# Altium schematic sheet Amplifier_1.SchDoc
size B; SheetNumber: 2; SheetTotal: 7; SPICEModelCacheXOIHOEUF: <root> / <DocumentId>XOIHOEUF</DocumentId> / </root>
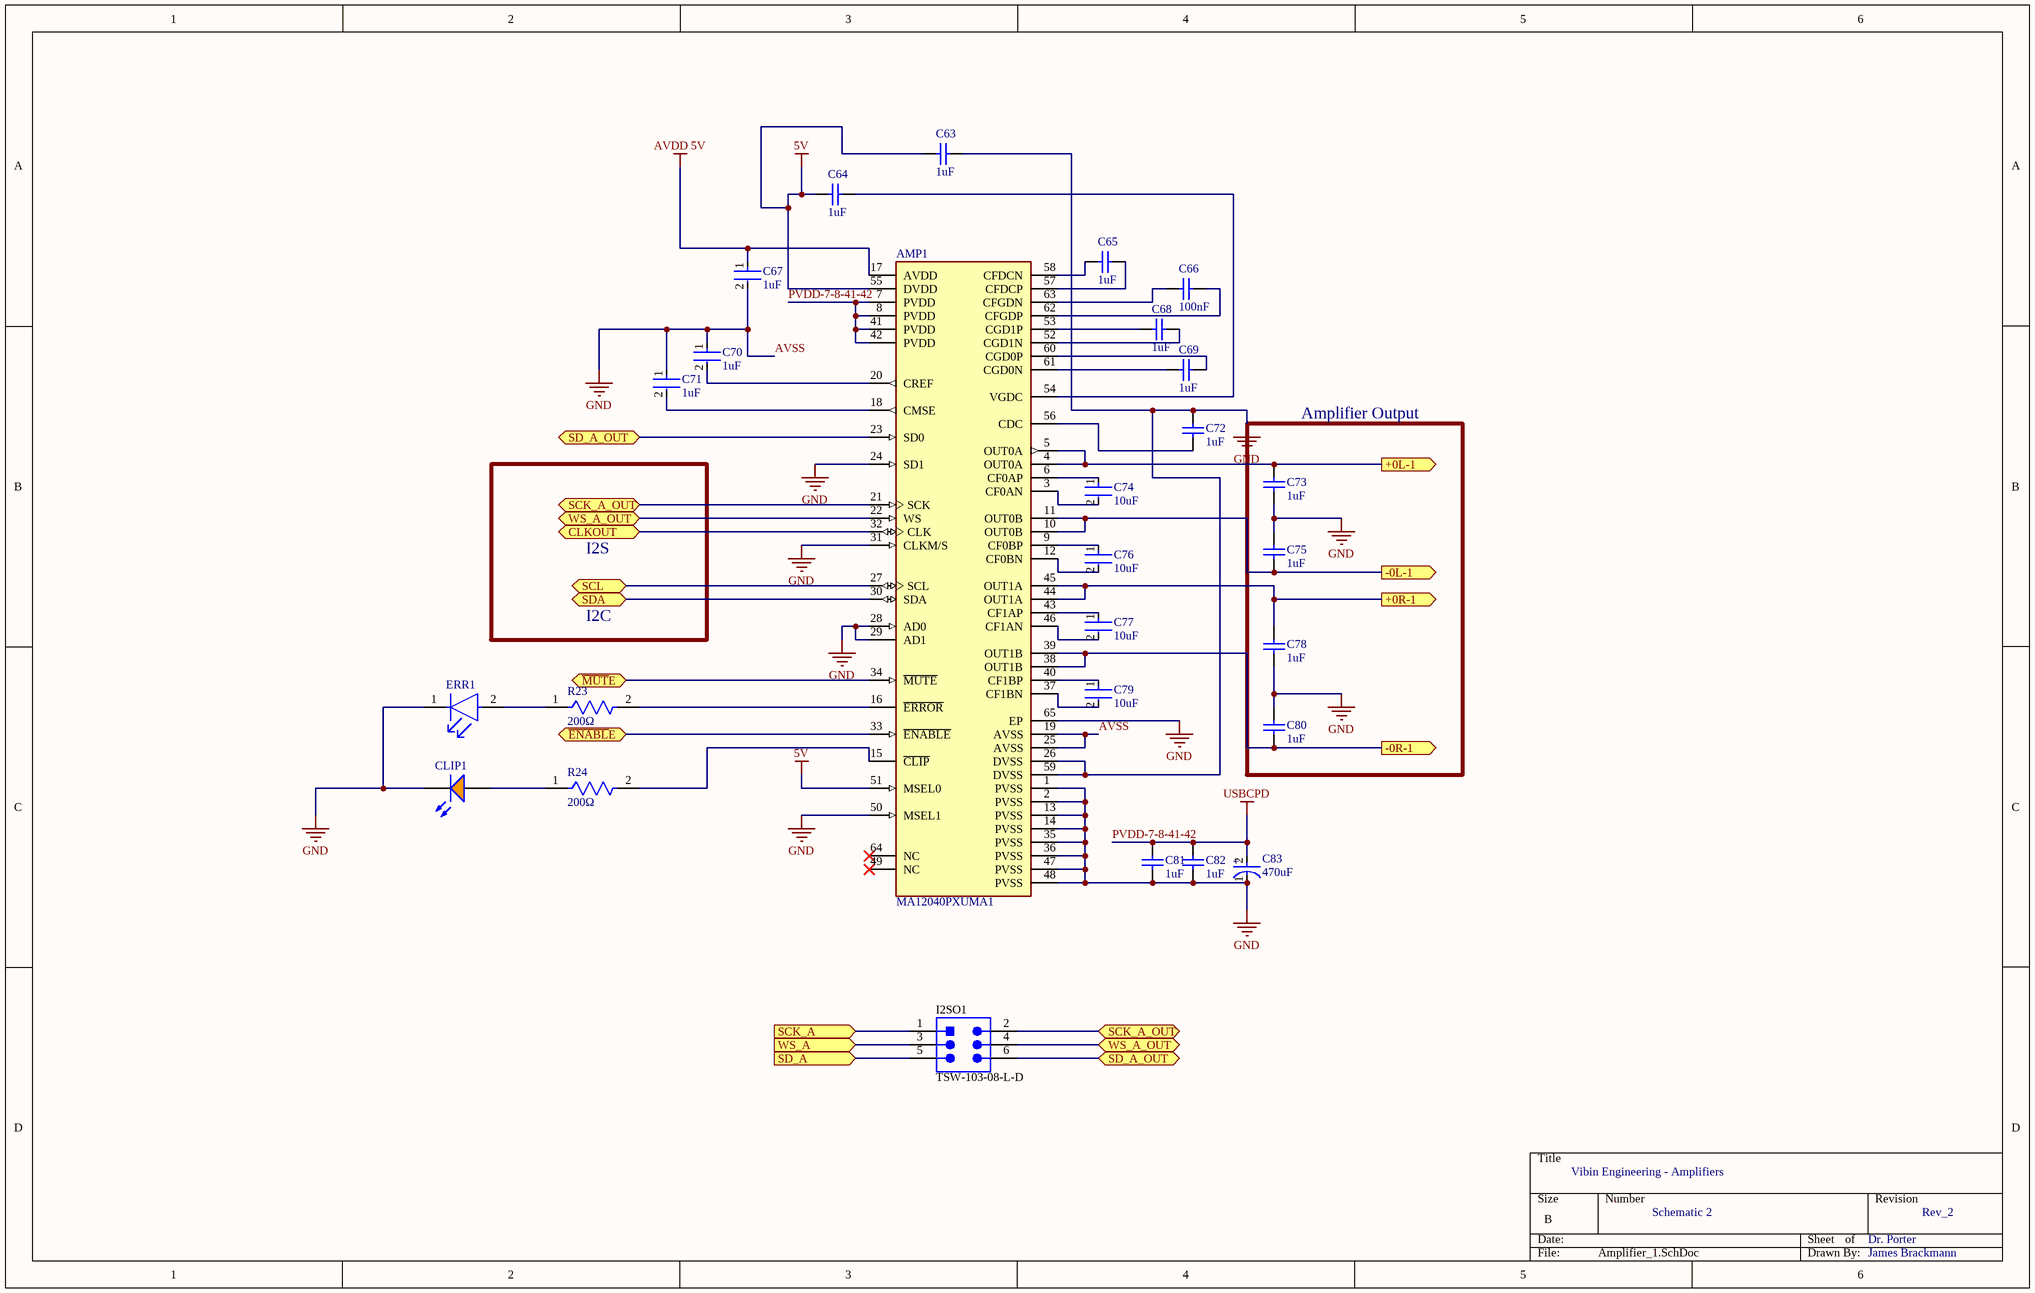
[diagram p0: Amplifier_1.SchDoc]

## Parts
AMP1  MA12040PXUMA1  [FP-PG-VQFN-64-IPC_B]
C63  1uF  [CAPC1608X90X35LL15T15]
C64  1uF  [CAPC1608X90X35LL15T15]
C65  1uF  [CAPC1608X90X35LL15T15]
C66  100nF  [CAPC1608X90X35ML10T15]
C67  1uF  [FP-GRM15-0_1-MFG]
C68  1uF  [CAPC1608X90X35LL15T15]
C69  1uF  [CAPC1608X90X35LL15T15]
C70  1uF  [FP-GRM15-0_1-MFG]
C71  1uF  [FP-GRM15-0_1-MFG]
C72  1uF  [CAPC1608X90X35LL15T15]
C73  1uF  [CAPC1608X90X35LL15T15]
C74  10uF  [FP-1210-L_3_3_0_4-W_2_5_0-MFG]
C75  1uF  [CAPC1608X90X35LL15T15]
C76  10uF  [FP-1210-L_3_3_0_4-W_2_5_0-MFG]
C77  10uF  [FP-1210-L_3_3_0_4-W_2_5_0-MFG]
C78  1uF  [CAPC1608X90X35LL15T15]
C79  10uF  [FP-1210-L_3_3_0_4-W_2_5_0-MFG]
C80  1uF  [CAPC1608X90X35LL15T15]
C81  1uF  [CAPC1608X90X35LL15T15]
C82  1uF  [CAPC1608X90X35LL15T15]
C83  470uF  [FP-OS-CON-SMT-E12-MFG]
CLIP1  TLMO1100-GS08  [VISH-TLMX1100-2_V]  (value not drawn)
ERR1  LTST-C190GKT  [FP-LTST-C190GKT-MFG]  (value not drawn)
I2SO1  TSW-103-08-L-D  [SMTC-TSW-103-08-L-D_V]
R23  200Ω  [FP-ERJ2RK-IPC_A]
R24  200Ω  [FP-ERJ2RK-IPC_A]

## Blocks framed on the sheet
Amplifier Output: C73 C75 C78 C80

## Ports
+0L-1 (out), +0R-1 (out), -0L-1 (out), -0R-1 (out), CLKOUT (bidir), SCK_A (in), SCK_A_OUT (bidir), SCL (bidir), SD_A (in), SD_A_OUT (bidir), SDA (bidir), WS_A (in), WS_A_OUT (bidir), ~{ENABL}E (bidir), ~{MUT}E (bidir)

## Nets
5V: AMP1.51(MSEL0) AMP1.55(DVDD) C63.2 C64.1
AVDD 5V: AMP1.17(AVDD) C67.1
AVSS: AMP1.1(PVSS) AMP1.2(PVSS) AMP1.13(PVSS) AMP1.14(PVSS) AMP1.19(AVSS) AMP1.24(SD1) AMP1.25(AVSS) AMP1.26(DVSS) AMP1.28(AD0) AMP1.29(AD1) AMP1.31(CLKM/S) AMP1.35(PVSS) AMP1.36(PVSS) AMP1.47(PVSS) AMP1.48(PVSS) AMP1.50(MSEL1) AMP1.59(DVSS) AMP1.65(EP) C63.1 C67.2 C70.1 C71.1 C72.1 C73.2 C75.1 C78.2 C80.1 C81.2 C82.2 C83.1(C) CLIP1.2(K) ERR1.1(C)  [also labelled GND]
PVDD-7-8-41-42: AMP1.7(PVDD) AMP1.8(PVDD) AMP1.41(PVDD) AMP1.42(PVDD) C81.1 C82.1 C83.2(A)  [also labelled USBCPD]
+0L-1: AMP1.4(OUT0A) AMP1.5(OUT0A) C73.1 ; port +0L-1
+0R-1: AMP1.44(OUT1A) AMP1.45(OUT1A) C78.1 ; port +0R-1
-0L-1: AMP1.10(OUT0B) AMP1.11(OUT0B) C75.2 ; port -0L-1
-0R-1: AMP1.38(OUT1B) AMP1.39(OUT1B) C80.2 ; port -0R-1
~{ENABL}E: AMP1.33(~{ENABLE}) ; port ~{ENABL}E
~{MUT}E: AMP1.34(~{MUTE}) ; port ~{MUT}E
CLKOUT: AMP1.32(CLK) ; port CLKOUT
SCK_A: I2SO1.1 ; port SCK_A
SCK_A_OUT: AMP1.21(SCK) I2SO1.2 ; port SCK_A_OUT
SCL: AMP1.27(SCL) ; port SCL
SD_A: I2SO1.5 ; port SD_A
SD_A_OUT: AMP1.23(SD0) I2SO1.6 ; port SD_A_OUT
SDA: AMP1.30(SDA) ; port SDA
WS_A: I2SO1.3 ; port WS_A
WS_A_OUT: AMP1.22(WS) I2SO1.4 ; port WS_A_OUT
NetAMP1_3: AMP1.3(CF0AN) C74.2
NetAMP1_6: AMP1.6(CF0AP) C74.1
NetAMP1_9: AMP1.9(CF0BP) C76.1
NetAMP1_12: AMP1.12(CF0BN) C76.2
NetAMP1_15: AMP1.15(~{CLIP}) R24.2
NetAMP1_16: AMP1.16(~{ERROR}) R23.2
NetAMP1_18: AMP1.18(CMSE) C71.2
NetAMP1_20: AMP1.20(CREF) C70.2
NetAMP1_37: AMP1.37(CF1BN) C79.2
NetAMP1_40: AMP1.40(CF1BP) C79.1
NetAMP1_43: AMP1.43(CF1AP) C77.1
NetAMP1_46: AMP1.46(CF1AN) C77.2
NetAMP1_52: AMP1.52(CGD1N) C68.1
NetAMP1_53: AMP1.53(CGD1P) C68.2
NetAMP1_54: AMP1.54(VGDC) C64.2
NetAMP1_56: AMP1.56(CDC) C72.2
NetAMP1_57: AMP1.57(CFDCP) C65.1
NetAMP1_58: AMP1.58(CFDCN) C65.2
NetAMP1_60: AMP1.60(CGD0P) C69.1
NetAMP1_61: AMP1.61(CGD0N) C69.2
NetAMP1_62: AMP1.62(CFGDP) C66.1
NetAMP1_63: AMP1.63(CFGDN) C66.2
NetCLIP1_1: CLIP1.1(A) R24.1
NetERR1_2: ERR1.2(A) R23.1

Not connected (* = marked no-connect by the designer): AMP1 49(NC)* 64(NC)*

## Notes on the sheet
- I2S
- I2C
- Vibin Engineering - Amplifiers
- Schematic 2
- Dr. Porter
- Rev_2
- James Brackmann
- (in symbol CMP-05428-001033-1) +

## Library data of the parts
AMP1 = CMP-32833-000001-1: IC AMP CLASS D STEREO 40W 64QFN; Manufacturer: Infineon; Max Junction Temp: +150°C; Max Supply Voltage: 18V; Output Current Per Channel: 6A; Number Of Channels: 1; Min Supply Voltage: 4V; Nominal Supply Current: 6-38mA; Power At Speaker R: 20W @ 8Ω; Ambient Temperature Range High: +85°C; Ambient Temperature Range Low: 0°C; RoHS: TRUE; Temperature: -40°C to +150°C; Device Class L1: Integrated Circuits (ICs); Height: 0.9mm; Lead Free: Yes; Octopart: https://octopart.com/ma12040pxuma1-infineon-95984592; ComponentLink2URL: https://www.infineon.com/dgdl/Infineon-MA12040P-DS-v01_00-EN.pdf?fileId=5546d46264a8de7e0164b74ff0e561a2; Category: IC; Manufacturer Part Number: MA12040PXUMA1; Temperature Range High: +150°C; Ipc Land Pattern Name: QFN50P900X900X90-64; Automotive: No; Digikey Description: IC AMP CLASS D STEREO 40W 64QFN; Device Class L2: Linear ICs; Device Class L3: Amplifiers - Audio; Temperature Range Low: -40°C; Footprint Url: https://www.infineon.com/cms/en/product/packages/PG-VQFN/PG-VQFN-64-6/; ComponentLink2Description: Datasheet; Package: PG-VQFN-64
C63-C65 C68 C69 C72 C73 C75 C78 C80-C82 = CMP-2006-02298-2: C0603C105K4RACTU; Manufacturer: Kemet; Part Number: C0603C105K4RACTU
C66 = CMP-2100-03643-1: Chip Capacitor, 0.1 uF, +/- 10%, 50 V, -55 to 125 degC, 0603 (1608 Metric), RoHS, Tape and Reel              GRM188R71H104KA93D; Manufacturer: Murata; Dielectric Material: Ceramic; Voltage Rating: 50V; Dielectric: X7R; Insulation Resistance: 10GR; Case Code (Metric): 1608; Lead Free: LeadFree; Depth: 0.8mm; Number of Pins: 2; Radiation Hardening: No; Case/Package: 0603; Manufacturer URL: http://www.murata.com/; Packaging: TapeandReel; Length: 1.6mm; Contact Plating: Tin; Datasheet URL: http://psearch.en.murata.com/capacitor/product/GRM188R71H104KA93%23.pdf; Tolerance: 10%; Case Code (Imperial): 0603; Min Operating Temperature: -55degC; RoHSCompliant: true; Capacitance: 100nF; Voltage: 50V; Termination: SMD/SMT; Mount: SurfaceMount; Material: Ceramic; Package Quantity: 1; Height: 0.8mm; Thickness: 0.035inch; REACH SVHC: NoSVHC; Max Operating Temperature: 125degC; Width: 0.8mm; Package Reference: 0603; Voltage Rating (DC): 50V; Datasheet Version: 42675.0; Package Description: 2-Pin Surface Mount Device, Body 1.6 x 0.8 mm
C67 C70 C71 = CMP-2008-04556-2: CAP CER 1UF 10V X5R 0402         GRM155R61A105KE15D; Manufacturer: Murata; Material: Ceramic; Tolerance: 10%; Temperature Coefficient: 15%; Octopart: https://octopart.com/grm155r61a105ke15d-murata-197442; Manufacturer Part Number: GRM155R61A105KE15D; Lead Free: Yes; ComponentLink2Description: Datasheet; Temperature: -55°C to +85°C; Temperature Range High: +85°C; Height: 0.55mm; Capacitance: 1uF; Ipc Land Pattern Name: CAPC10050X50; ComponentLink2URL: https://search.murata.co.jp/Ceramy/image/img/A01X/G101/ENG/GRM155R61A105KE15-01A.pdf; Temperature Range Low: -55°C; Device Class L2: Capacitors; Voltage Rating: 10V; RoHS: TRUE; Device Class L1: Passive Components; Device Class L3: Ceramic Capacitors; Temperature Characteristic: X5R; Mouser Description: 0402 1 uF 10 V ±10% Tolerance X5R Surface Mount Multilayer Ceramic Capacitor; Automotive: No; Package: GRM15-0.1; Digikey Description: CAP CER 1UF 10V X5R 0402; Value: 1uF; Category: Cap
C74 C76 C77 C79 = CMP-2000-05477-2: General Purpose Ceramic Capacitor, 1210, 10uF, 10%, X5R, 15%, 25V        12103D106KAT2A; Lead Free: Lead Free; Max Operating Temperature: 85°C; REACH SVHC: No SVHC; Depth: 2.5mm; Packaging: Tape and Reel; Min Operating Temperature: -55°C; Height: 2.29mm; Construction: Flat; Case Code (Imperial): 1210; Radiation Hardening: No; Voltage: 25V; Case/Package: 1210; Series: -; Dielectric: X5R; Length: 3.2mm; Thickness: 0.11inch; Package Quantity: 1; Termination: SMD/SMT; Case Code (Metric): 3225; Voltage Rating (DC): 25V; Voltage Rating: 25V; Contact Plating: Tin; RoHS Compliant: Yes; Mount: Surface Mount; Width: 0.098inch; Capacitance: 10uF; Tolerance: 10%
C83 = CMP-05428-001033-1: Conductive Polymer Aluminum Solid Capacitors (OS-CON) 470uF ±20% 20V      20SVPK470M; ESR (Equivalent Series Resistance): 14mR; Life (Hours): 1000Hour; Capacitance: 470uF; Mount: Surface Mount; Max Operating Temperature: 125°C; Min Operating Temperature: -55°C; Case/Package: Radial; Tolerance: 20%; Voltage Rating: 20V; Packaging: Tape and Reel
CLIP1 = CMP-1666-00029-1: Orange LED, 20 mA, 2.1 V, -40 to 100 degC, 2-Pin SMD (0603), RoHS, Tape and Reel           TLMO1100-GS08; Forward Voltage: 1 V; Forward Current: 150 mA; Capacitance: -323 f; Recovery Time: 4 ns; Peak Reverse Current: 5 uA; ComponentLink1URL: http://www.vishay.com/; Width: 1.35 mm; PackageReference: 0603; Min Operating Temperature: -55 degC; Packaging: Tape and Reel; RoHSCompliant: true; ComponentLink2Description: Datasheet; PackageDescription: 2-Pin Surface Mount Device, Body 1.6 x 0.8 mm; DatasheetVersion: Rev. 2.7, 03/2016; Pins: 2; Max Operating Temperature: 150 degC; Radiation Hardening: No; Package Quantity: 3000; ComponentLink1Description: Manufacturer URL; Mount: Surface Mount; REACH SVHC: No SVHC; Length: 1.8 mm; ComponentLink2URL: http://download.siliconexpert.com/pdfs/2016/8/7/12/43/26/667/vsh_/manual/379263299541529tlmb1100.pdf; Height: 1 mm
ERR1 = CMP-22017-000005-2: LED GREEN CLEAR CHIP SMD       LTST-C190GKT; Dominant Wavelength: 569nm; Reverse Voltage: 5V; Lens Color: Colorless; Viewing Angle: 130°; Voltage: 2V; Forward Current: 30mA; Power Dissipation: 100mW; Luminous Intensity: 6mcd; Number of LEDs: 1; Forward Voltage: 2.1V; Wavelength: 565nm; Test Current: 10mA; Min Operating Temperature: -55°C; Lens Style: Clear; Mount: Surface Mount; Width: 0.8mm; Packaging: Tape and Reel; Lens Transparency: Clear; Case Code (Metric): 1608; Depth: 0.8mm; Case Code (Imperial): 0603; Case/Package: 0603; Number of Pins: 2; Max Operating Temperature: 85°C; Lead Free: Lead Free; Number of Elements: 1; Length: 1.6mm; Height: 0.8mm; Package Quantity: 1; Power Rating: 100mW; Radiation Hardening: No; Illumination Color: Green; Color: Green
I2SO1 = CMP-1024-00336-5: Male Header, Pitch 2.54 mm, 2 x 3 Position, Height 8.38 mm, Tail Length 5.08 mm, -55 to 125 degC, RoHS, Bulk; Manufacturer: Samtec; DatasheetVersion: 04/2012; ComponentLink3URL: http://suddendocs.samtec.com/prints/tsw-xxx-xx-x-x-xx-xxx-footprint.pdf; PackageReference: TSW-103-08-L-D; Mounting Technology: Through Hole; Min Operating Temperature: -55 degC; ComponentLink2Description: Datasheet; Lead Pitch: 2.54 mm; ComponentLink1Description: Manufacturer URL; Mount: Through Hole; ComponentLink1URL: http://www.samtec.com/; ComponentLink3Description: Package Specification; Max Operating Temperature: 125 degC; PackageDescription: Male Header, Pitch 2.54 mm, 2 x 3 Position, Height 8.38 mm, Tail Length 5.08 mm; ComponentLink2URL: https://datasheet.ciiva.com/25618/0900766b81154476-25618436.pdf; RoHSCompliant: true
R23 = CMP-2002-00757-2: RES SMD 200 OHM 1% 1/10W 0402      ERJ-2RKF2000X; Power Rating: 100mW; Voltage Rating (DC): 50V; Resistance: 200R; Temperature Coefficient: 100ppm/°C; RoHS Compliant: Yes; Packaging: Tape and Reel; Case Code (Metric): 1005; Package Quantity: 1; Contact Plating: Tin; Series: ERJ; Mount: Surface Mount; Lead Free: Lead Free; Min Operating Temperature: -55°C; Number of Terminations: 2; Max Power Dissipation: 100mW; Technology: THICK FILM; Voltage Rating: 50V; Case/Package: 0402; Width: 0.02inch; Termination: SMD/SMT; Military Standard: Not; Height: 0.35mm; Radiation Hardening: No; Resistance Tolerance: 1%; Length: 1mm; REACH SVHC: No SVHC; Construction: Rectangular; Depth: 0.5mm; Features: Automotive AEC-Q200; Resistor Type: Thick Film; Case Code (Imperial): 0402; Tolerance: 1%; Size Code: 0402; Max Operating Temperature: 155°C
R24 = CMP-2002-00757-2: RES SMD 200 OHM 1% 1/10W 0402    ERJ-2RKF2000X; Power Rating: 100mW; Voltage Rating (DC): 50V; Resistance: 200R; Temperature Coefficient: 100ppm/°C; RoHS Compliant: Yes; Packaging: Tape and Reel; Case Code (Metric): 1005; Package Quantity: 1; Contact Plating: Tin; Series: ERJ; Mount: Surface Mount; Lead Free: Lead Free; Min Operating Temperature: -55°C; Number of Terminations: 2; Max Power Dissipation: 100mW; Technology: THICK FILM; Voltage Rating: 50V; Case/Package: 0402; Width: 0.02inch; Termination: SMD/SMT; Military Standard: Not; Height: 0.35mm; Radiation Hardening: No; Resistance Tolerance: 1%; Length: 1mm; REACH SVHC: No SVHC; Construction: Rectangular; Depth: 0.5mm; Features: Automotive AEC-Q200; Resistor Type: Thick Film; Case Code (Imperial): 0402; Tolerance: 1%; Size Code: 0402; Max Operating Temperature: 155°C